# EAGLE schematic Remote (EAGLE 5.11)
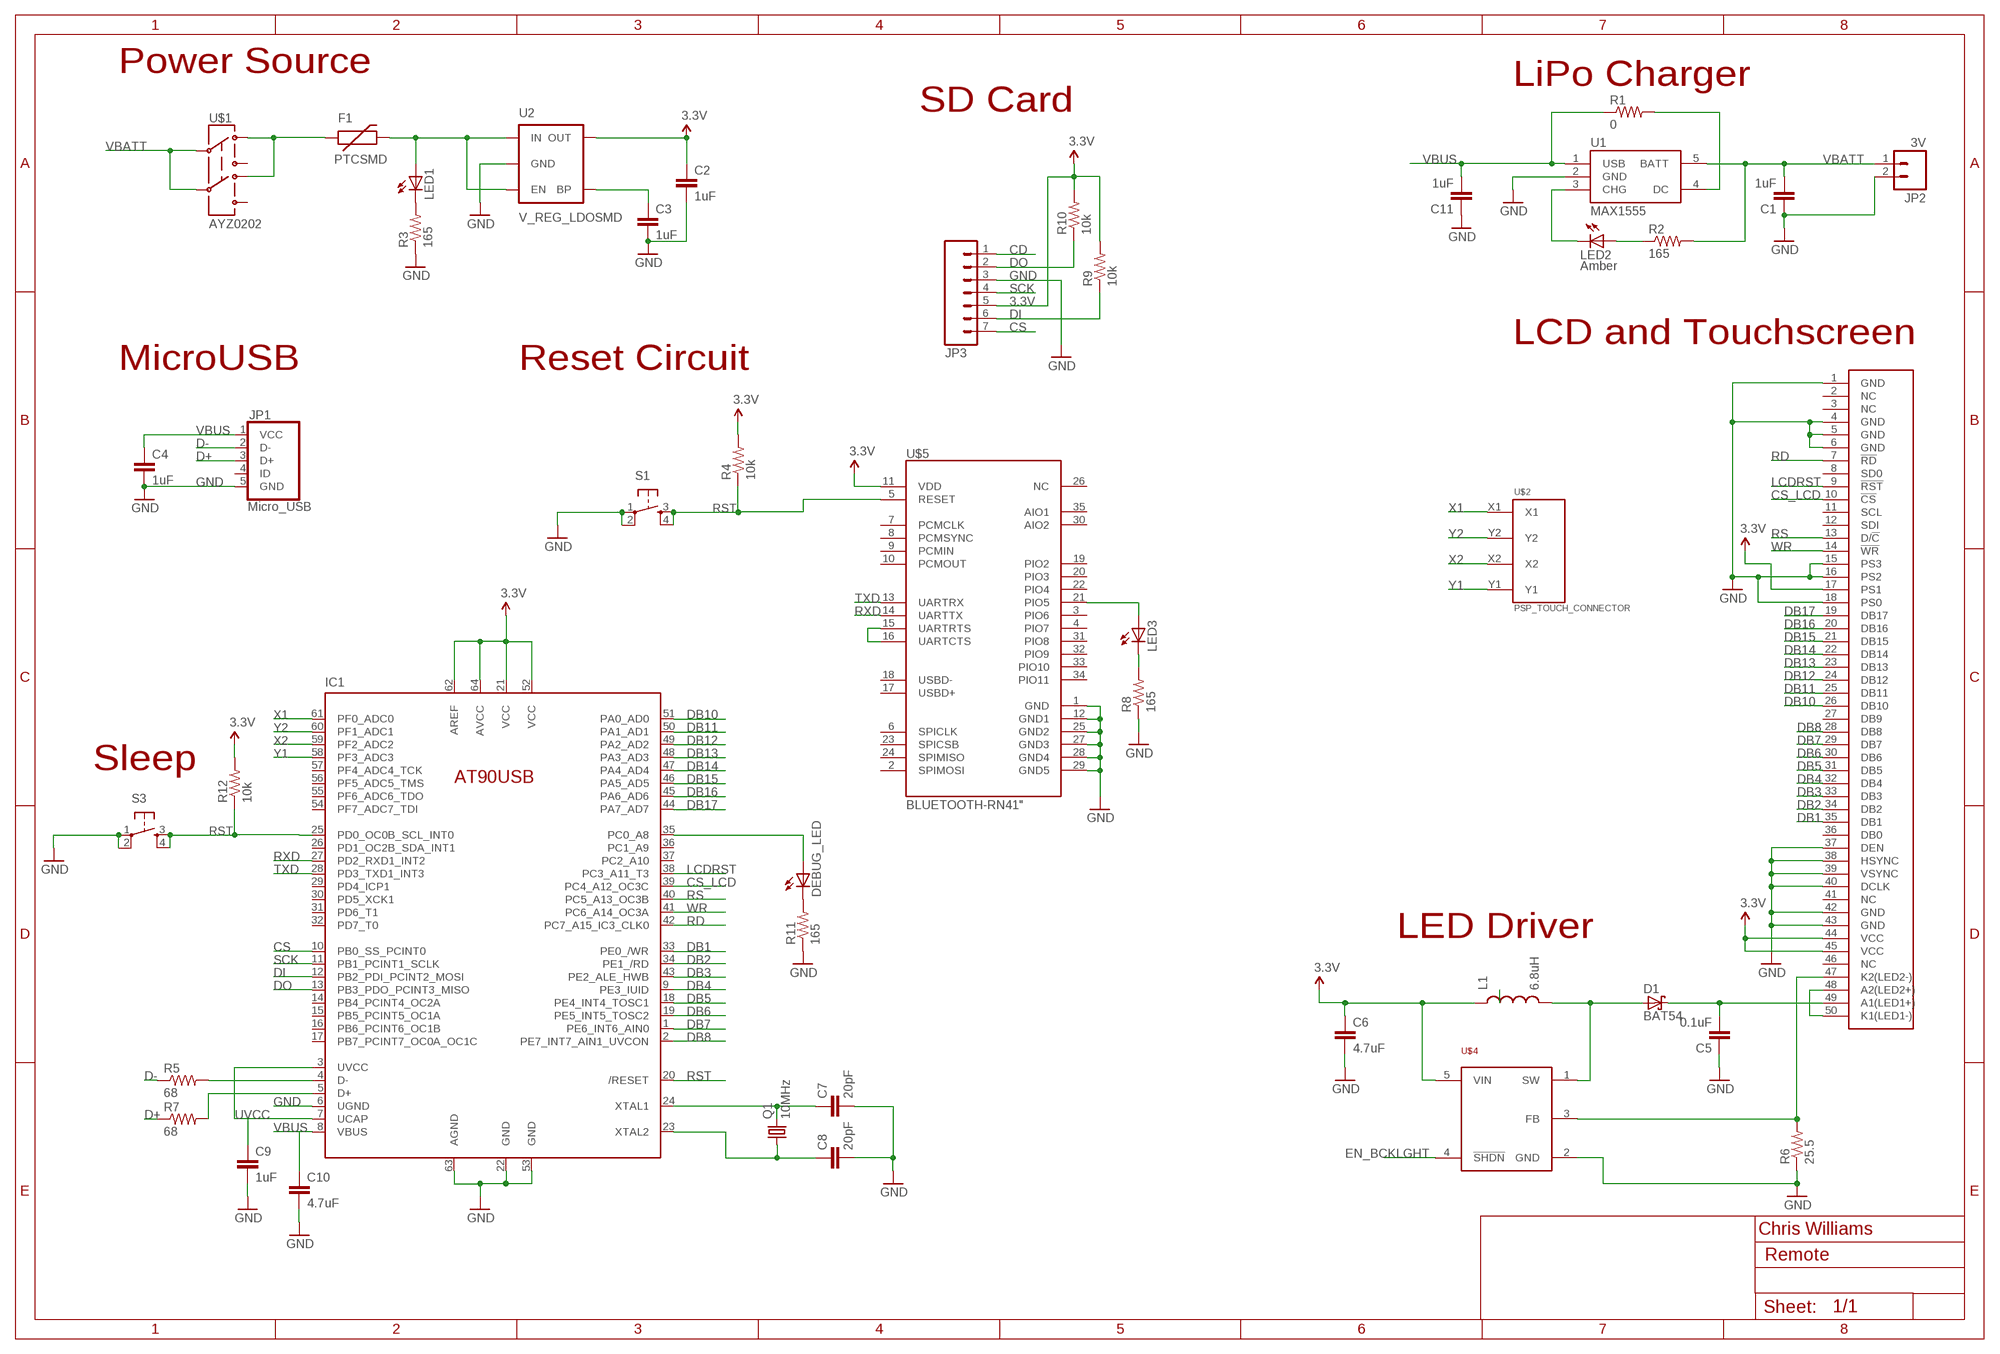
[diagram p0: schematic, sheet 1]

## Parts
C1  1uF  CAP1206  [1206]
C2  1uF  CAP1206  [1206]
C3  1uF  CAP1206  [1206]
C4  1uF  CAP1206  [1206]
C5  0.1uF  CAP1206  [1206]
C6  4.7uF  CAP1206  [1206]
C7  20pF  CAP1206  [1206]
C8  20pF  CAP1206  [1206]
C9  1uF  CAP1206  [1206]
C10  4.7uF  CAP1206  [1206]
C11  1uF  CAP1206  [1206]
D1  BAT54  [SOT23]
DEBUG_LED  LEDCHIPLED_1206  [CHIPLED_1206]
F1  PTCSMD  [PTC-1206]
IC1  AT90USB-TQFP  [TQFP64]
JP1  Micro_USB  USB_MICROB_PLUG  [MICRO-B-RA-SMT]
JP2  3V  M02JST-PTH-2  [JST-2-PTH]
JP3  M07  [1X07]
L1  6.8uH  INDUCTOR1206H*  [INDUCTOR-1206]
LED1  LEDCHIPLED_1206  [CHIPLED_1206]
LED2  Amber  LEDCHIPLED_1206  [CHIPLED_1206]
LED3  LEDCHIPLED_1206  [CHIPLED_1206]
Q1  10MHz  CRYSTAL10.5X4.8  [CRYSTAL-SMD-10.5X4.8-2PIN]
R1  0  RESISTOR1206  [1206]
R2  165  RESISTOR1206  [1206]
R3  165  RESISTOR1206  [1206]
R4  10k  RESISTOR1206  [1206]
R5  68  RESISTOR1206  [1206]
R6  25.5  RESISTOR1206  [1206]
R7  68  RESISTOR1206  [1206]
R8  165  RESISTOR1206  [1206]
R9  10k  RESISTOR1206  [1206]
R10  10k  RESISTOR1206  [1206]
R11  165  RESISTOR1206  [1206]
R12  10k  RESISTOR1206  [1206]
S1  TAC_SWITCHSMD  [TACTILE_SWITCH_SMD]
S3  TAC_SWITCHPTH  [TACTILE-PTH]
U1  MAX1555  [SOT23-5]
U2  V_REG_LDOSMD  [SOT23-5]
U$1  AYZ0202  [AYZ0202]
U$2  PSP_TOUCH_CONNECTOR  [PSP_TOUCH_CONNECTOR]
U$3  CFAF320240F-035T  [GRAPHIC_LCD]
U$4  FAN5333  [SOT-23-5]
U$5  BLUETOOTH-RN41"  [RN41]

## Nets
3.3V: C2.1 C6.1 IC1.21(VCC) IC1.52(VCC) IC1.62(AREF) IC1.64(AVCC) JP3.5 L1.P$1 R4.2 R9.2 R10.2 R12.2 U2.5(OUT) U$3.17(PS1) U$3.44(VCC) U$3.45(VCC) U$4.5(VIN) U$5.11(VDD)
CD: JP3.1
CS: IC1.10(PB0_SS_PCINT0) JP3.7
CS_LCD: IC1.39(PC4_A12_OC3C) U$3.10(!CS!)
D+: JP1.3(D+) R7.1
D-: JP1.2(D-) R5.1
DB1: IC1.33(PE0_/WR) U$3.35(DB1)
DB2: IC1.34(PE1_/RD) U$3.34(DB2)
DB3: IC1.43(PE2_ALE_HWB) U$3.33(DB3)
DB4: IC1.9(PE3_IUID) U$3.32(DB4)
DB5: IC1.18(PE4_INT4_TOSC1) U$3.31(DB5)
DB6: IC1.19(PE5_INT5_TOSC2) U$3.30(DB6)
DB7: IC1.1(PE6_INT6_AIN0) U$3.29(DB7)
DB8: IC1.2(PE7_INT7_AIN1_UVCON) U$3.28(DB8)
DB10: IC1.51(PA0_AD0) U$3.26(DB10)
DB11: IC1.50(PA1_AD1) U$3.25(DB11)
DB12: IC1.49(PA2_AD2) U$3.24(DB12)
DB13: IC1.48(PA3_AD3) U$3.23(DB13)
DB14: IC1.47(PA4_AD4) U$3.22(DB14)
DB15: IC1.46(PA5_AD5) U$3.21(DB15)
DB16: IC1.45(PA6_AD6) U$3.20(DB16)
DB17: IC1.44(PA7_AD7) U$3.19(DB17)
DI: IC1.12(PB2_PDI_PCINT2_MOSI) JP3.6 R9.1
DO: IC1.13(PB3_PDO_PCINT3_MISO) JP3.2 R10.1
EN_BCKLGHT: U$4.4(!SHDN!)
GND: C1.1 C2.2 C3.2 C4.2 C5.1 C6.2 C7.2 C8.2 C9.2 C10.2 C11.1 IC1.6(UGND) IC1.22(GND) IC1.53(GND) IC1.63(AGND) JP1.5(GND) JP2.2 JP3.3 R3.1 R6.1 R8.1 R11.1 S1.1 S1.2 S3.1 S3.2 U1.2(GND) U2.2(GND) U$3.1(GND) U$3.4(GND) U$3.5(GND) U$3.6(GND) U$3.15(PS3) U$3.16(PS2) U$3.18(PS0) U$3.37(DEN) U$3.38(HSYNC) U$3.39(VSYNC) U$3.40(DCLK) U$3.42(GND) U$3.43(GND) U$4.2(GND) U$5.1(GND) U$5.12(GND1) U$5.25(GND2) U$5.27(GND3) U$5.28(GND4) U$5.29(GND5)
LCDRST: IC1.38(PC3_A11_T3) U$3.9(!RST!)
N$1: C7.1 IC1.24(XTAL1) Q1.P$2
N$2: C8.1 IC1.23(XTAL2) Q1.P$1
N$3: F1.1 U$1.3 U$1.6
N$4: F1.2 LED1.A U2.1(IN) U2.3(EN)
N$5: IC1.4(D-) R5.2
N$6: IC1.5(D+) R7.2
N$7: LED1.C R3.2
N$8: C3.1 U2.4(BP)
N$9: U$5.15(UARTRTS) U$5.16(UARTCTS)
N$10: LED3.A U$5.21(PIO5)
N$11: LED3.C R8.2
N$12: LED2.A R2.1
N$13: DEBUG_LED.C R11.2
N$14: R1.2 U1.4(DC)
N$15: D1.1(A) L1.P$2 U$4.1(SW)
N$16: C5.2 D1.3(C) U$3.49(A1(LED1+))
N$17: U$3.48(A2(LED2+)) U$3.50(K1(LED1-))
N$18: R6.2 U$3.47(K2(LED2-)) U$4.3(FB)
N$19: LED2.C U1.3(CHG)
N$20: DEBUG_LED.A IC1.35(PC0_A8)
RD: IC1.42(PC7_A15_IC3_CLK0) U$3.7(!RD!)
RS: IC1.40(PC5_A13_OC3B) U$3.13(D/!C!)
RST: IC1.20(/RESET) IC1.25(PD0_OC0B_SCL_INT0) R4.1 R12.1 S1.3 S1.4 S3.3 S3.4 U$5.5(RESET)
RXD: IC1.27(PD2_RXD1_INT2) U$5.14(UARTTX)
SCK: IC1.11(PB1_PCINT1_SCLK) JP3.4
TXD: IC1.28(PD3_TXD1_INT3) U$5.13(UARTRX)
UVCC: C9.1 IC1.3(UVCC) IC1.7(UCAP)
VBATT: C1.2 JP2.1 R2.2 U1.5(BATT) U$1.2 U$1.5
VBUS: C4.1 C10.1 C11.2 IC1.8(VBUS) JP1.1(VCC) R1.1 U1.1(USB)
WR: IC1.41(PC6_A14_OC3A) U$3.14(!WR!)
X1: IC1.61(PF0_ADC0) U$2.X1
X2: IC1.59(PF2_ADC2) U$2.X2
Y1: IC1.58(PF3_ADC3) U$2.Y1
Y2: IC1.60(PF1_ADC1) U$2.Y2
Unconnected: IC1.14(PB4_PCINT4_OC2A) IC1.15(PB5_PCINT5_OC1A) IC1.16(PB6_PCINT6_OC1B) IC1.17(PB7_PCINT7_OC0A_OC1C) IC1.26(PD1_OC2B_SDA_INT1) IC1.29(PD4_ICP1) IC1.30(PD5_XCK1) IC1.31(PD6_T1) IC1.32(PD7_T0) IC1.36(PC1_A9) IC1.37(PC2_A10) IC1.54(PF7_ADC7_TDI) IC1.55(PF6_ADC6_TDO) IC1.56(PF5_ADC5_TMS) IC1.57(PF4_ADC4_TCK) JP1.4(ID) U$1.1 U$1.4 U$3.2(NC) U$3.3(NC) U$3.8(SD0) U$3.11(SCL) U$3.12(SDI) U$3.27(DB9) U$3.36(DB0) U$3.41(NC) U$3.46(NC) U$5.2(SPIMOSI) U$5.3(PIO6) U$5.4(PIO7) U$5.6(SPICLK) U$5.7(PCMCLK) U$5.8(PCMSYNC) U$5.9(PCMIN) U$5.10(PCMOUT) U$5.17(USBD+) U$5.18(USBD-) U$5.19(PIO2) U$5.20(PIO3) U$5.22(PIO4) U$5.23(SPICSB) U$5.24(SPIMISO) U$5.26(NC) U$5.30(AIO2) U$5.31(PIO8) U$5.32(PIO9) U$5.33(PIO10) U$5.34(PIO11) U$5.35(AIO1)

## Notes on the sheet
- Power Source
- LiPo Charger
- SD Card
- LCD and Touchscreen
- MicroUSB | Reset Circuit
- Sleep
- LED Driver
- Chris Williams

## Library data of the parts
C1-C11 = SparkFun:CAP: Capacitor Standard 0603 ceramic capacitor, and 0.1" leaded capacitor.
D1 = diode:BAT54: Schottky Diodes Source: Fairchild .. BAT54.pdf
DEBUG_LED LED1-LED3 = led:LED: LED OSRAM: - CHIPLED LG R971, LG N971, LY N971, LG Q971, LY Q971, LO R971, LY R971 LH N974, LH R974 LS Q976, LO Q976, LY Q976 LO Q996 - Hyper CHIPLED LW Q18S LB Q993, LB Q99A, LB R99A - SideLED LS A670, LO A670, LY A670, LG A670, LP A670 LB A673, LV A673, LT A673, LW A673 LH A674 LY A675 LS A676, LA A676, LO A676, LY A676, LW A676 LS A679, LY A679, LG A679 - Hyper Micro SIDELED® LS Y876, LA Y876, LO Y876, LY Y876 LT Y87S - SmartLED LW L88C, LW L88S LB L89C, LB L89S, LG L890 LS L89K, LO L89K, LY L89K LS L896, LA L896, LO L896, LY L896 - TOPLED LS T670, LO T670, LY T670, LG T670, LP T670 LSG T670, LSP T670, LSY T670, LOP T670, LYG T670 LG T671, LOG T671, LSG T671 LB T673, LV T673, LT T673, LW T673 LH T674 LS T676, LA T676, LO T676, LY T676, LB T676, LH T676, LSB T676, LW T676 LB T67C, LV T67C, LT T67C, LS T67K, LO T67K, LY T67K, LW E67C LS E67B, LA E67B, LO E67B, LY E67B, LB E67C, LV E67C, LT E67C LW T67C LS T679, LY T679, LG T679 LS T770, LO T770, LY T770, LG T770, LP T770 LB T773, LV T773, LT T773, LW T773 LH T774 LS E675, LA E675, LY E675, LS T675 LS T776, LA T776, LO T776, LY T776, LB T776 LHGB T686 LT T68C, LB T68C - Hyper Mini TOPLED® LB M676 - Mini TOPLED Santana® LG M470 LS M47K, LO M47K, LY M47K Source: http://www.osram.convergy.de LUXEON: - LUMILED® LXK2-PW12-R00, LXK2-PW12-S00, LXK2-PW14-U00, LXK2-PW14-V00 LXK2-PM12-R00, LXK2-PM12-S00, LXK2-PM14-U00 LXK2-PE12-Q00, LXK2-PE12-R00, LXK2-PE12-S00, LXK2-PE14-T00, LXK2-PE14-U00 LXK2-PB12-K00, LXK2-PB12-L00, LXK2-PB12-M00, LXK2-PB14-N00, LXK2-PB14-P00, LXK2-PB14-Q00 LXK2-PR12-L00, LXK2-PR12-M00, LXK2-PR14-Q00, LXK2-PR14-R00 LXK2-PD12-Q00, LXK2-PD12-R00, LXK2-PD12-S00 LXK2-PH12-R00, LXK2-PH12-S00 LXK2-PL12-P00, LXK2-PL12-Q00, LXK2-PL12-R00 Source: www.luxeon.com KINGBRIGHT: KA-3528ASYC Source: www.kingbright.com
F1 = SparkFun:PTC: Resettable Fuse PTC Resettable Fuse. Spark Fun Electronics SKU : COM-08357
IC1 = controller-micro_atmel_jd:AT90USB
JP1 = SparkFun:USB_MICROB_PLUG: USB Micro-B Plug Comes in a variety of packages. Check out Hirose's ZX-x0 line: http://www.hirose.co.jp/cataloge_hp/e24200011.pdf
JP2 = SparkFun:M02: Header 2 Standard 2-pin 0.1" header. Use with straight break away headers (SKU : PRT-00116), right angle break away headers (PRT-00553), swiss pins (PRT-00743), machine pins (PRT-00117), and female headers (PRT-00115). Molex polarized connector foot print use with SKU : PRT-08233 with associated crimp pins and housings.
JP3 = SparkFun:M07: Header 7 Standard 7-pin 0.1" header. Use with straight break away headers (SKU : PRT-00116), right angle break away headers (PRT-00553), swiss pins (PRT-00743), machine pins (PRT-00117), and female headers (PRT-00115). NOTES ON THE VARIANTS LOCK and LOCK_LONGPADS... This footprint was designed to help hold the alignment of a through-hole component (i.e. 7-pin header) while soldering it into place. You may notice that each hole has been shifted either up or down by 0.005 of an inch from it's more standard position (which is usually a perfectly straight line). This slight alteration caused the pins (the squares in the middle) to touch the edges of the holes. Because they are alternating, it causes a "brace" to hold the header in place. 0.005 has proven to be the perfect amount of "off-center" position when using our standard breakaway headers. Although looks a little odd when you look at the bare footprint, once you have a header in there, the alteration is very hard to notice. Also, if you push a header all the way into place, it is covered up entirely on the bottom side. This idea of altering the position of holes to aid alignment will be further integrated into the Sparkfun Library for other footprints. It can help hold any component with 3 or more connection pins.
L1 = SparkFun:INDUCTOR: Inductors Basic Inductor/Choke - 0603 and 1206. Footprints are not proven and vary greatly between part numbers.
Q1 = SparkFun:CRYSTAL: Crystals Various standard crystals. Proven footprints. Spark Fun Electronics SKU : COM-00534
R1-R12 = SparkFun:RESISTOR: Resistor Basic schematic elements and footprints for 0603, 1206, and PTH resistors.
S1 S3 = SparkFun:TAC_SWITCH: Momentary Switch Button commonly used for reset or general input. Spark Fun Electronics SKU : COM-00097
U1 = SparkFun:MAX1555: MAX1555 Lithium Charger IC SOT-23 Lithium Polymer charging IC. Schematic element and footprint proven. Spark Fun Electronics SKU : COM-00674
U2 = SparkFun:V_REG_LDO: Voltage Regulator LDO Standard 150mA LDO voltage regulator in SOT-23 layout. Micrel part MIC5205. BP (by-pass) pin is used to lower output noise with 470pF cap.
U$1 = SparkFun:AYZ0202: SPDT Slide Switch Simple SMD single-pull double-throw slide switch. Good for less than 350mA power switch, switching UARTs between devices, etc. Spark Fun Electronics SKU : COM-00597
U$2 = SparkFun:PSP_TOUCH_CONNECTOR: 4-Pin Connector for PSP Touch Screen
U$3 = CSW:CFAF320240F-035T: 3.5 inch diagonal, full-color QVGA graphic TFT display module The touchscreen can be found in separate libraries. Any 4-pin, 0.5" connector will work. https://www.crystalfontz.com/product/CFAF320240F035T.html
U$4 = fairchild-semic:FAN5333
U$5 = SparkFun:BLUETOOTH-RN41